# EAGLE schematic controller (EAGLE 9.6.0)
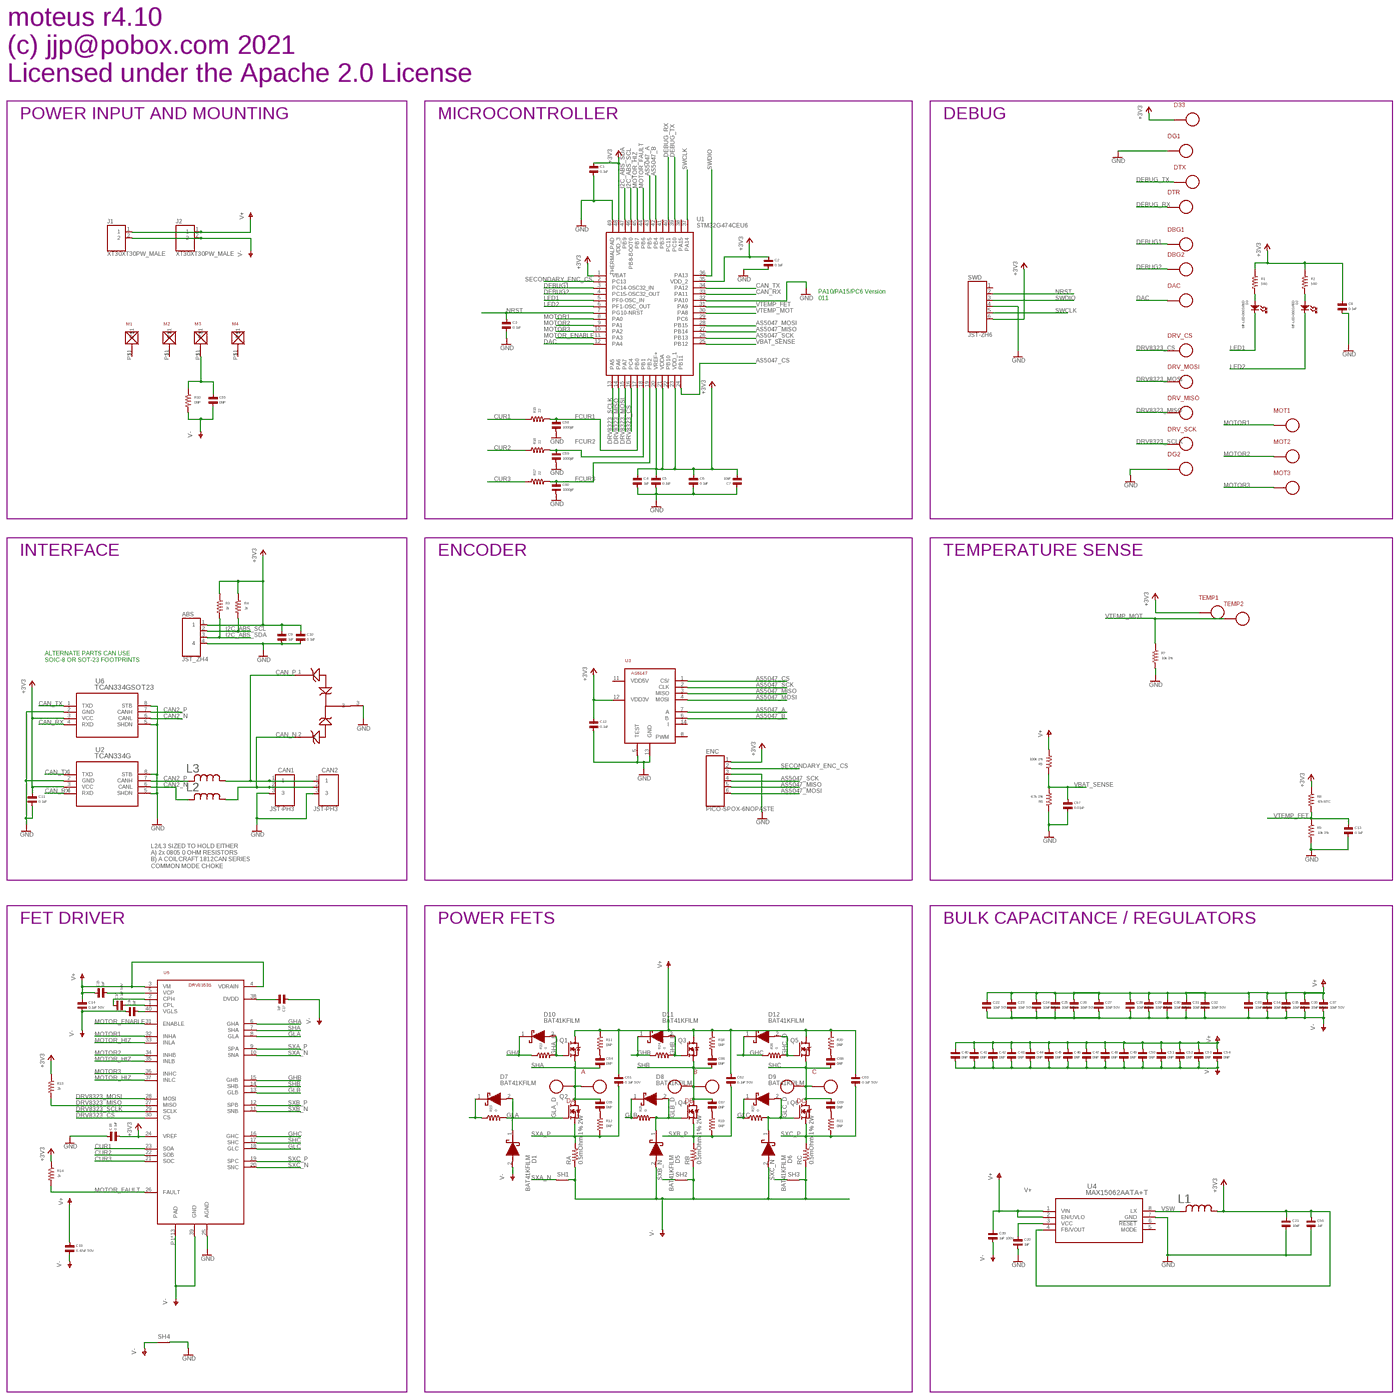
[diagram p0: schematic, sheet 1, overview]
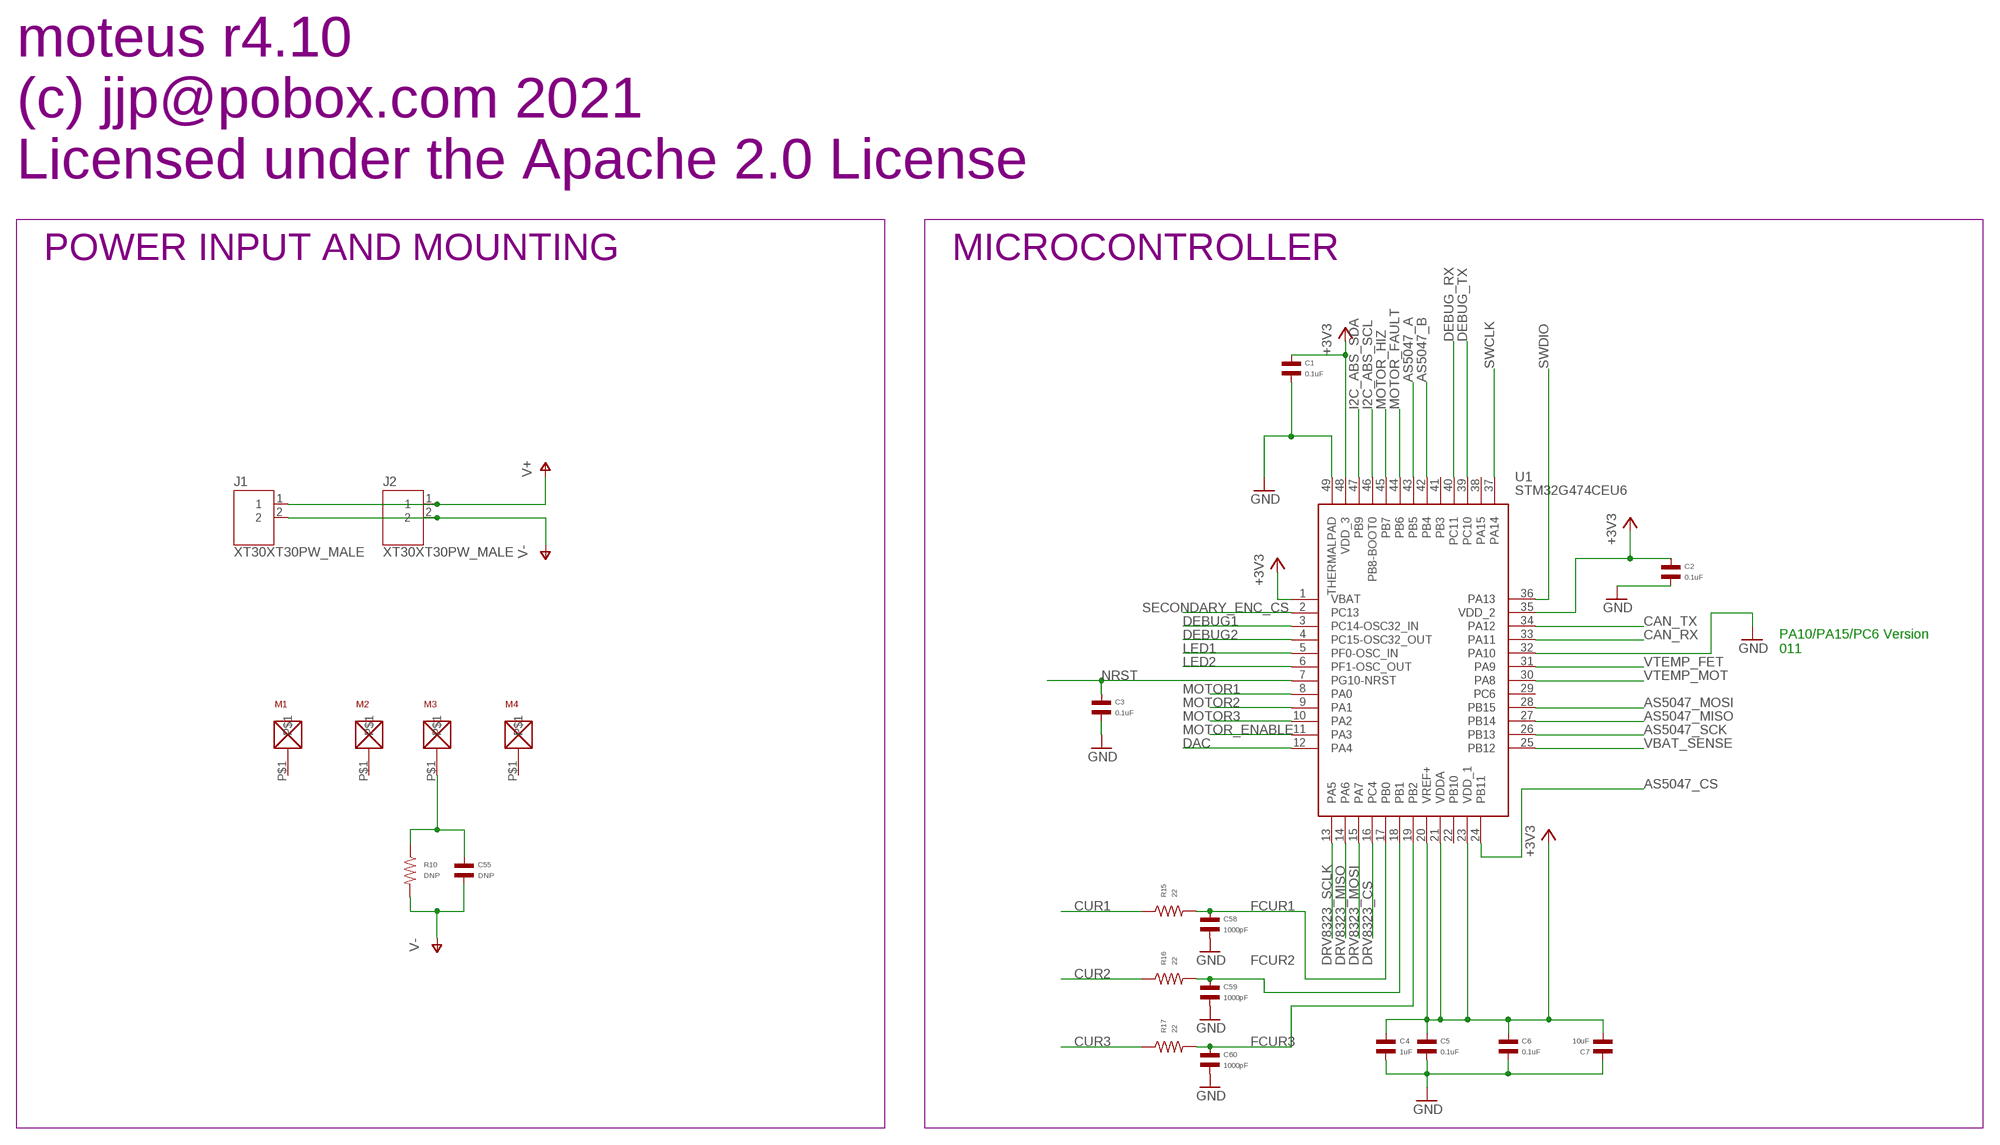
[diagram p1: schematic, sheet 1, part 1 of 4]
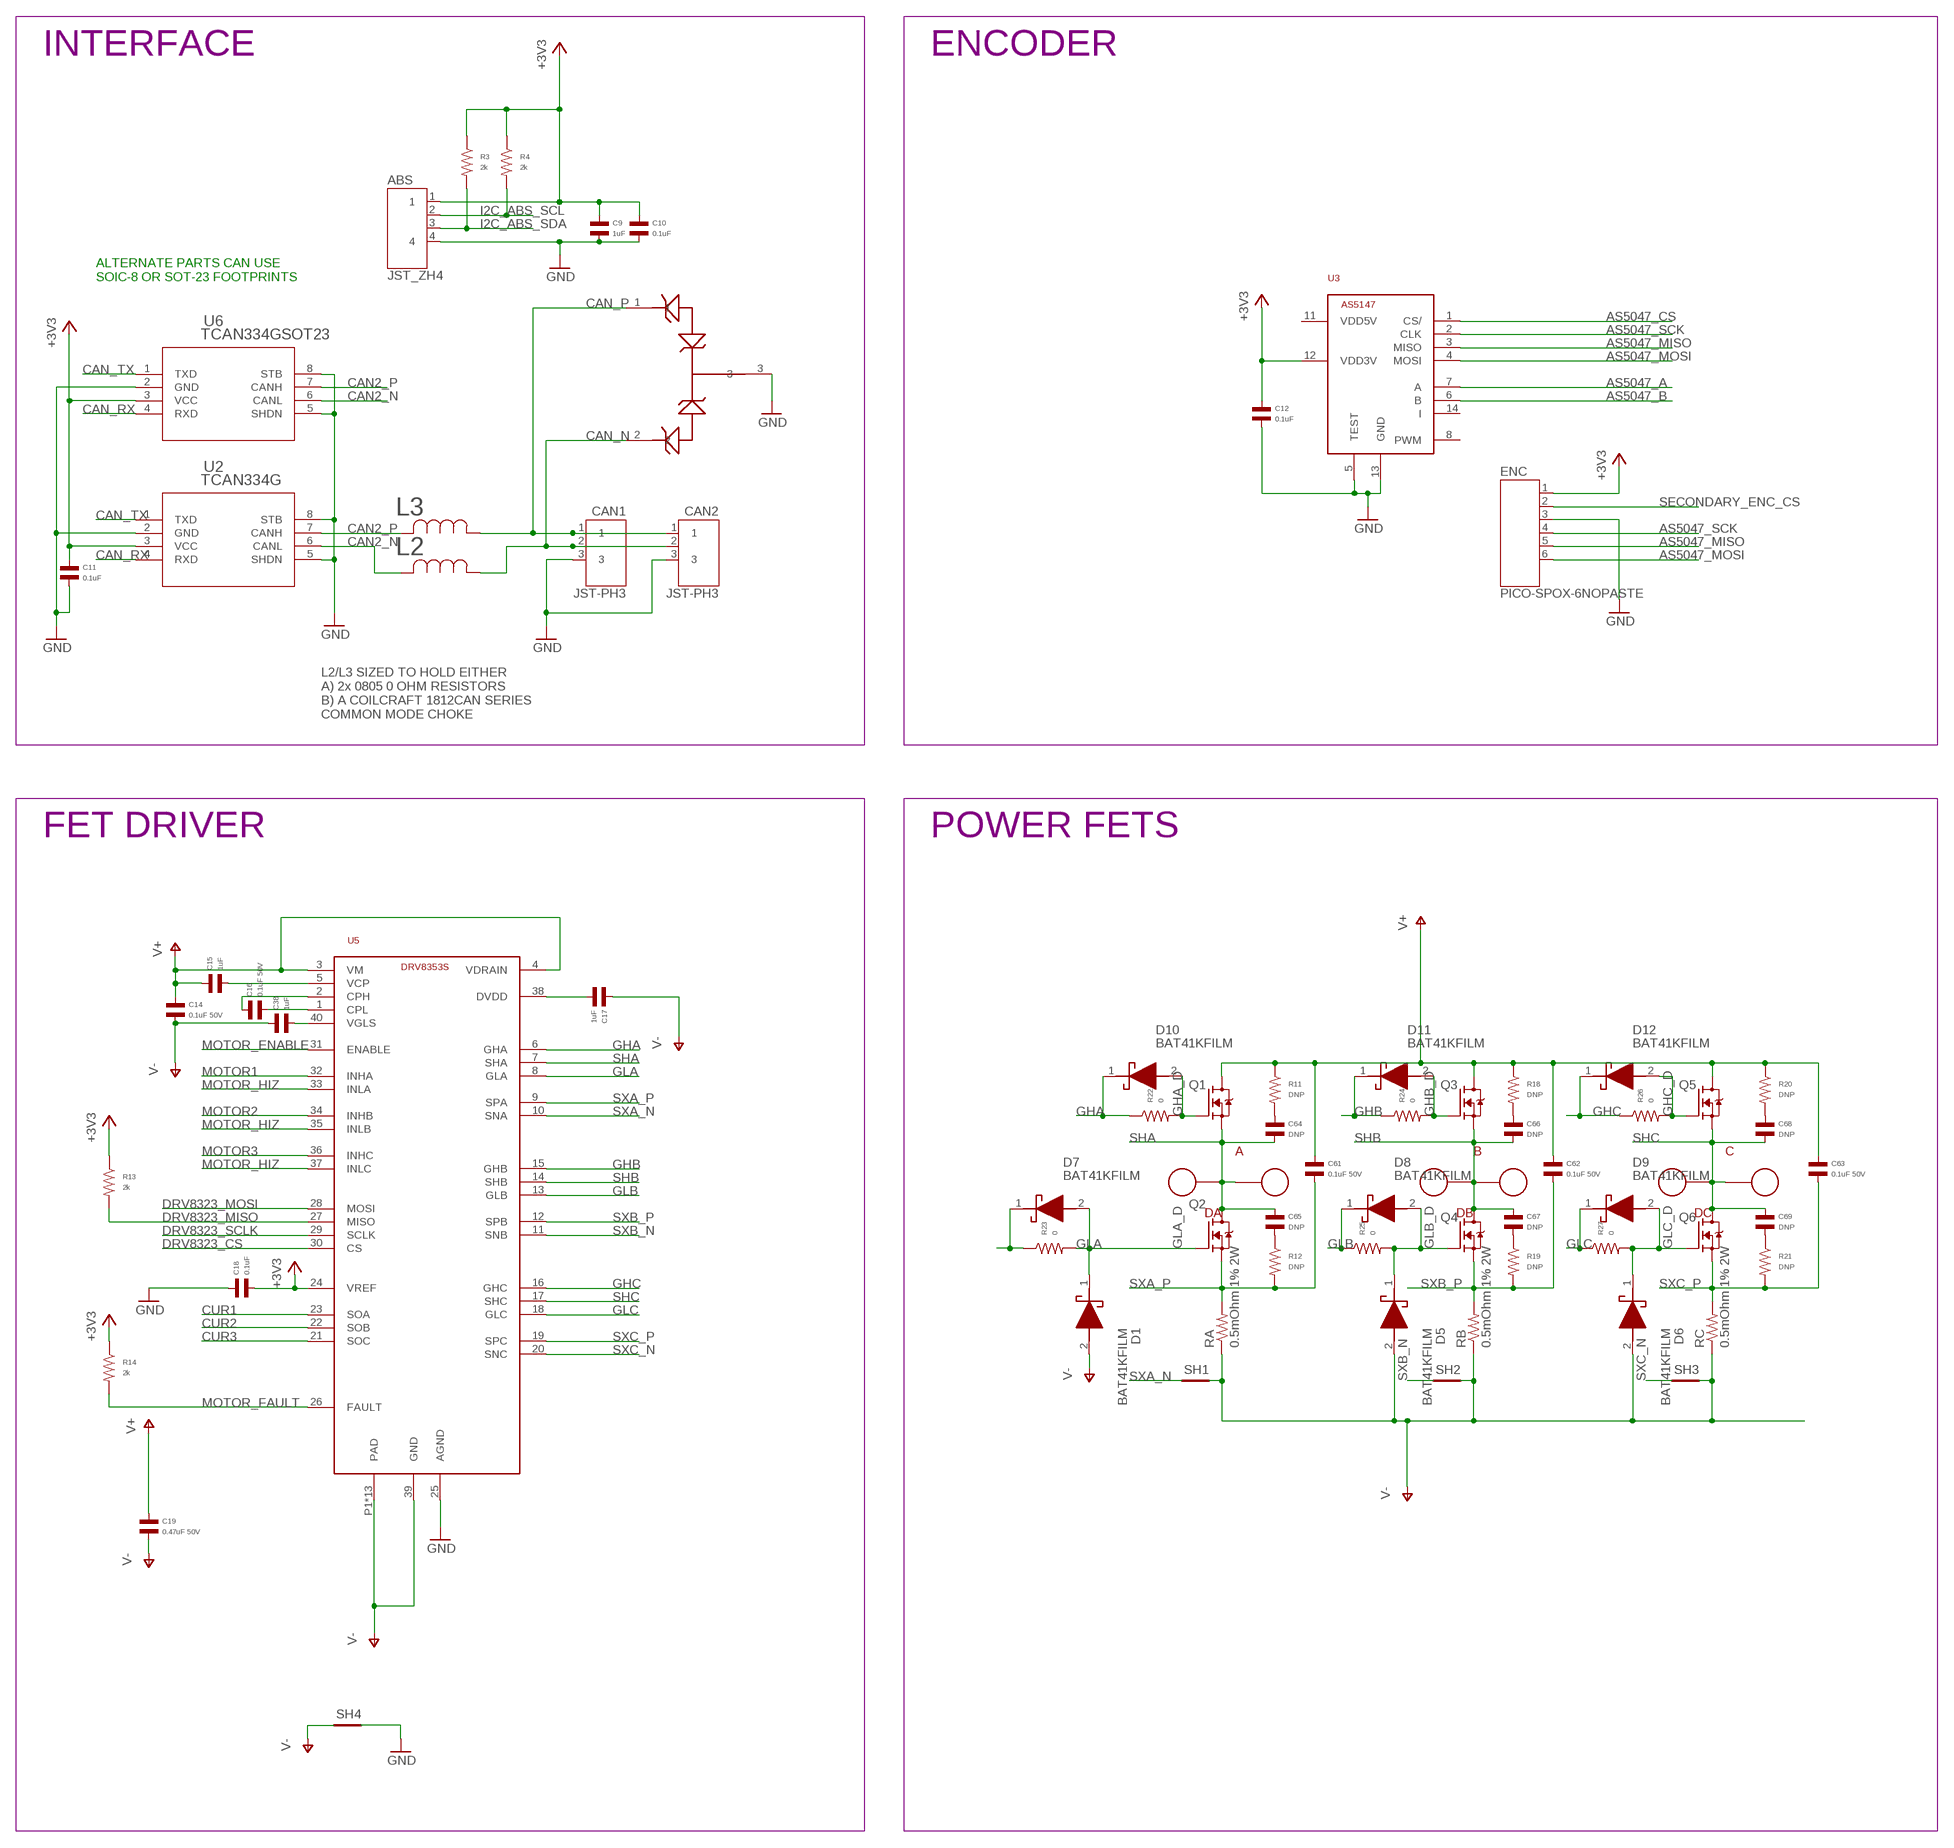
[diagram p2: schematic, sheet 1, part 2 of 4]
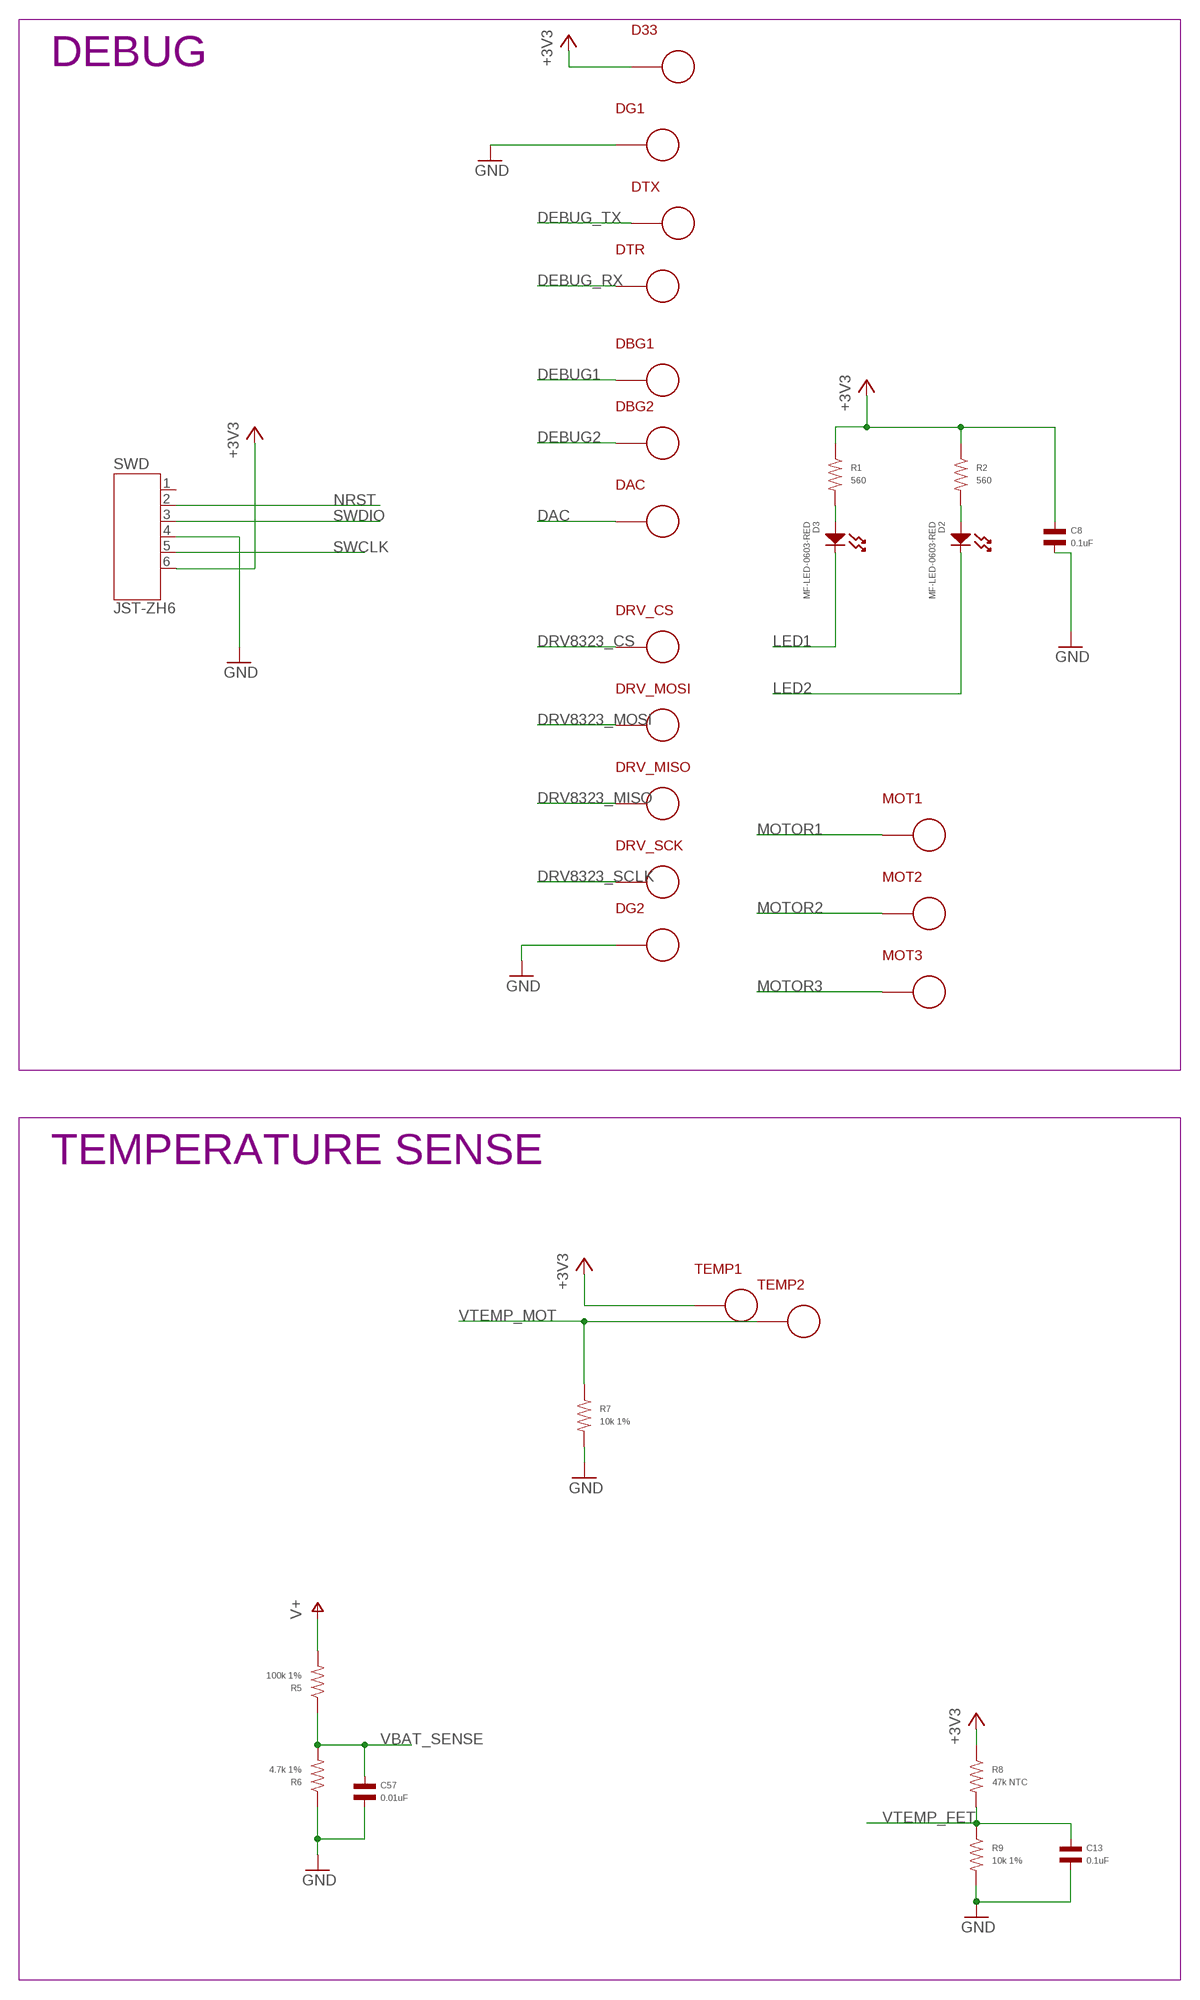
[diagram p3: schematic, sheet 1, part 3 of 4]
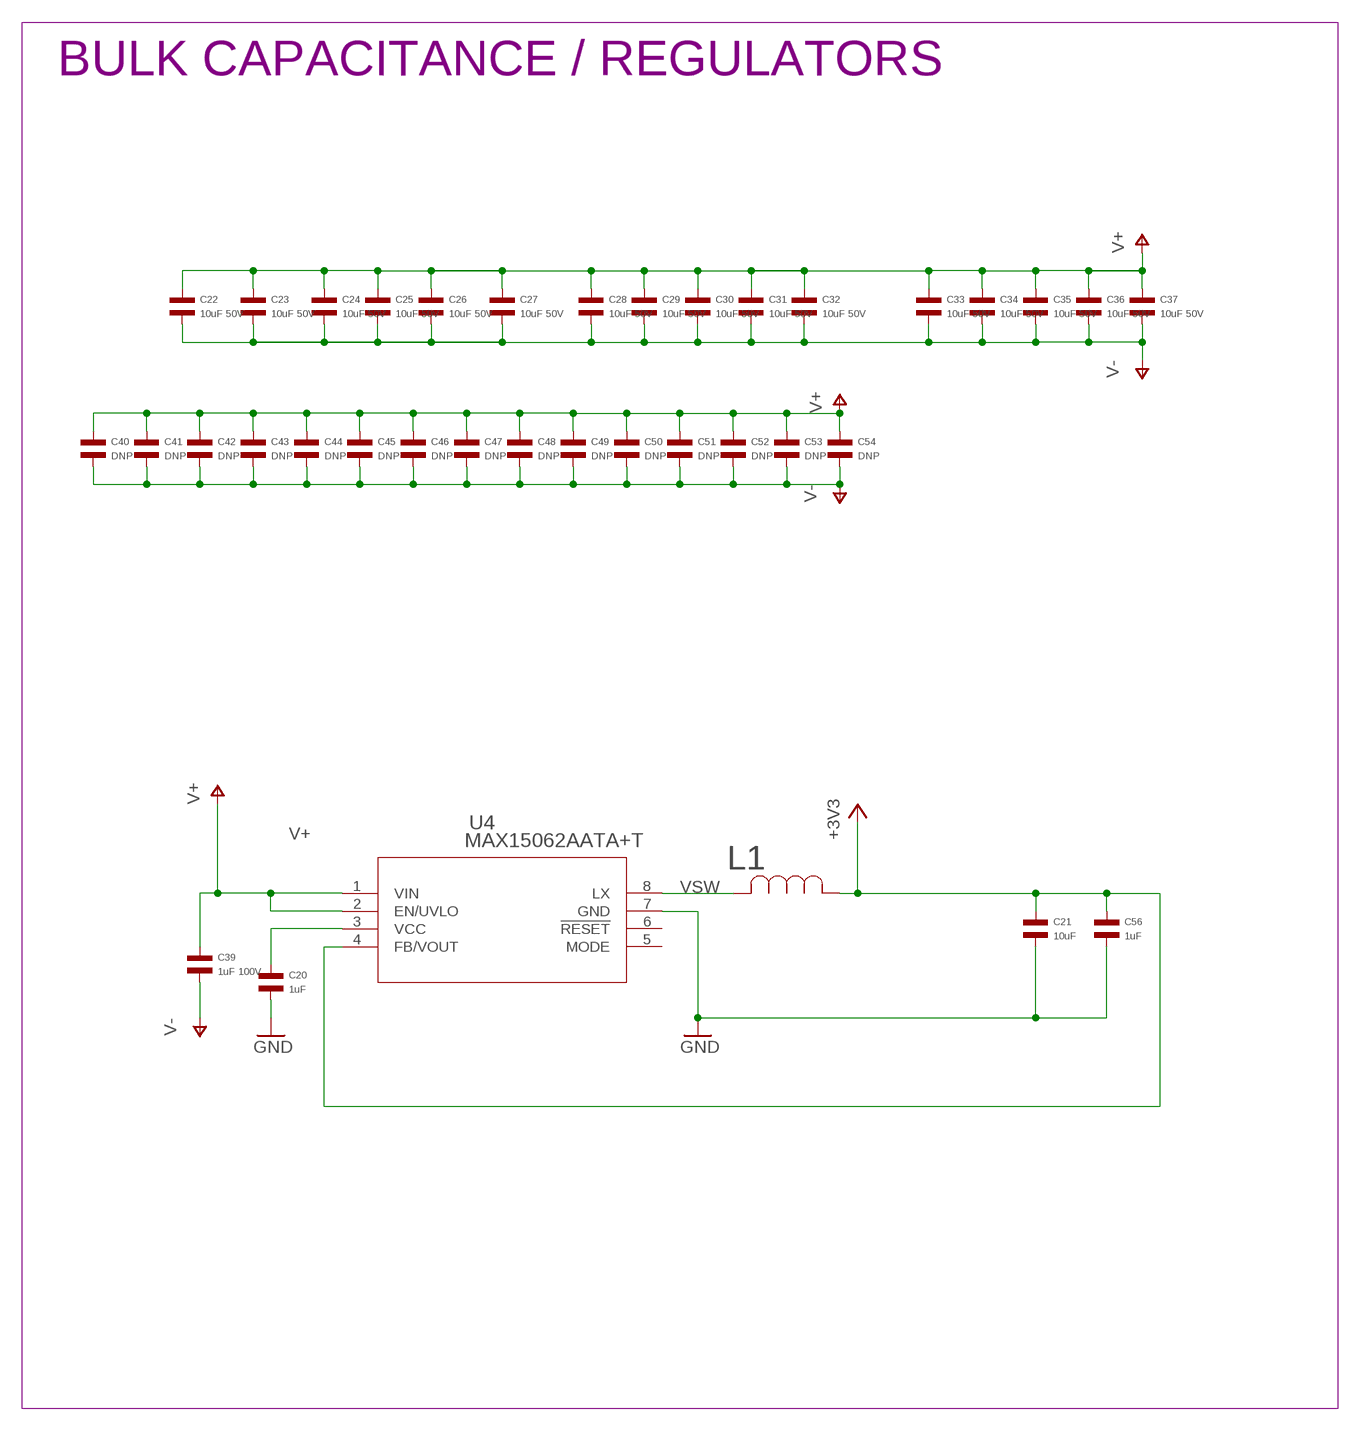
[diagram p4: schematic, sheet 1, part 4 of 4]

## Parts
A  PAD16AWG_PAD  [16AWG_PAD]
ABS  JST_ZH4  [JST_S4B-ZR-SM4A-TF(LF)(SN)]
B  PAD16AWG_PAD  [16AWG_PAD]
C  PAD16AWG_PAD  [16AWG_PAD]
C1  0.1uF  CAPACITOR_NP_0402  [C0402]
C2  0.1uF  CAPACITOR_NP_0402  [C0402]
C3  0.1uF  CAPACITOR_NP_0402  [C0402]
C4  1uF  CAPACITOR_NP_0402  [C0402]
C5  0.1uF  CAPACITOR_NP_0402  [C0402]
C6  0.1uF  CAPACITOR_NP_0402  [C0402]
C7  10uF  CAPACITOR_NP_1206  [C1206]
C8  0.1uF  CAPACITOR_NP_0402  [C0402]
C9  1uF  CAPACITOR_NP_0402  [C0402]
C10  0.1uF  CAPACITOR_NP_0402  [C0402]
C11  0.1uF  CAPACITOR_NP_0402_NOBORDER  [C0402_NOBORDER]
C12  0.1uF  CAPACITOR_NP_0402  [C0402]
C13  0.1uF  CAPACITOR_NP_0402  [C0402]
C14  0.1uF 50V  CAPACITOR_NP_0402  [C0402]
C15  1uF  CAPACITOR_NP_0402  [C0402]
C16  0.1uF 50V  CAPACITOR_NP_0402  [C0402]
C17  1uF  CAPACITOR_NP_0402  [C0402]
C18  0.1uF  CAPACITOR_NP_0402  [C0402]
C19  0.47uF 50V  CAPACITOR_NP_0402  [C0402]
C20  1uF  CAPACITOR_NP_0603  [C0603]
C21  10uF  CAPACITOR_NP_1206  [C1206]
C22  10uF 50V  CAPACITOR_NP_1206  [C1206]
C23  10uF 50V  CAPACITOR_NP_1206  [C1206]
C24  10uF 50V  CAPACITOR_NP_1206  [C1206]
C25  10uF 50V  CAPACITOR_NP_1206  [C1206]
C26  10uF 50V  CAPACITOR_NP_1206  [C1206]
C27  10uF 50V  CAPACITOR_NP_1206  [C1206]
C28  10uF 50V  CAPACITOR_NP_1206  [C1206]
C29  10uF 50V  CAPACITOR_NP_1206  [C1206]
C30  10uF 50V  CAPACITOR_NP_1206  [C1206]
C31  10uF 50V  CAPACITOR_NP_1206  [C1206]
C32  10uF 50V  CAPACITOR_NP_1206  [C1206]
C33  10uF 50V  CAPACITOR_NP_1206  [C1206]
C34  10uF 50V  CAPACITOR_NP_1206  [C1206]
C35  10uF 50V  CAPACITOR_NP_1206_NOBORDER  [C1206_NOBORDER]
C36  10uF 50V  CAPACITOR_NP_1206  [C1206]
C37  10uF 50V  CAPACITOR_NP_1206  [C1206]
C38  1uF  CAPACITOR_NP_0603  [C0603]
C39  1uF 100V  CAPACITOR_NP_0805  [C0805]
C40  DNP  CAPACITOR_NP_1206_NOCREAM  [C1206_NOCREAM]
C41  DNP  CAPACITOR_NP_1206_NOCREAM  [C1206_NOCREAM]
C42  DNP  CAPACITOR_NP_1206_NOCREAM  [C1206_NOCREAM]
C43  DNP  CAPACITOR_NP_1206_NOCREAM  [C1206_NOCREAM]
C44  DNP  CAPACITOR_NP_1206_NOCREAM  [C1206_NOCREAM]
C45  DNP  CAPACITOR_NP_1206_NOCREAM  [C1206_NOCREAM]
C46  DNP  CAPACITOR_NP_1206_NOCREAM  [C1206_NOCREAM]
C47  DNP  CAPACITOR_NP_1206_NOCREAM  [C1206_NOCREAM]
C48  DNP  CAPACITOR_NP_1206_NOCREAM  [C1206_NOCREAM]
C49  DNP  CAPACITOR_NP_1206_NOCREAM  [C1206_NOCREAM]
C50  DNP  CAPACITOR_NP_1206_NOCREAM  [C1206_NOCREAM]
C51  DNP  CAPACITOR_NP_1206_NOCREAM  [C1206_NOCREAM]
C52  DNP  CAPACITOR_NP_1206_NOCREAM  [C1206_NOCREAM]
C53  DNP  CAPACITOR_NP_1206_NOCREAM  [C1206_NOCREAM]
C54  DNP  CAPACITOR_NP_1206_NOCREAM  [C1206_NOCREAM]
C55  DNP  CAPACITOR_NP_0402  [C0402]
C56  1uF  CAPACITOR_NP_0402  [C0402]
C57  0.01uF  CAPACITOR_NP_0402  [C0402]
C58  1000pF  CAPACITOR_NP_0402_NOBORDER  [C0402_NOBORDER]
C59  1000pF  CAPACITOR_NP_0402_NOBORDER  [C0402_NOBORDER]
C60  1000pF  CAPACITOR_NP_0402_NOBORDER  [C0402_NOBORDER]
C61  0.1uF 50V  CAPACITOR_NP_1206  [C1206]
C62  0.1uF 50V  CAPACITOR_NP_0603_NOBORDER  [C0603_NOBORDER]
C63  0.1uF 50V  CAPACITOR_NP_1206  [C1206]
C64  DNP  CAPACITOR_NP_0603  [C0603]
C65  DNP  CAPACITOR_NP_0603  [C0603]
C66  DNP  CAPACITOR_NP_0603  [C0603]
C67  DNP  CAPACITOR_NP_0603  [C0603]
C68  DNP  CAPACITOR_NP_0603  [C0603]
C69  DNP  CAPACITOR_NP_0603  [C0603]
CAN1  JST-PH3  [JST_S3B-PH-SM4-TB(LF)(SN)]
CAN2  JST-PH3  [JST_S3B-PH-SM4-TB(LF)(SN)]
D1  BAT41KFILM  [SODFL1608X70N]
D2  MF-LED-0603-RED  LED_SINGLE-0603-RED  [LED0603]
D3  MF-LED-0603-RED  LED_SINGLE-0603-RED  [LED0603]
D4  DUAL_TVS  [SOT23-3]
D5  BAT41KFILM  [SODFL1608X70N]
D6  BAT41KFILM  [SODFL1608X70N]
D7  BAT41KFILM  [SODFL1608X70N]
D8  BAT41KFILM  [SODFL1608X70N]
D9  BAT41KFILM  [SODFL1608X70N]
D10  BAT41KFILM  [SODFL1608X70N]
D11  BAT41KFILM  [SODFL1608X70N]
D12  BAT41KFILM  [SODFL1608X70N]
D33  PAD24AWG_PAD  [24AWG_PAD]
DA  PAD24AWG_PAD  [24AWG_PAD]
DAC  PAD24AWG_PAD  [24AWG_PAD]
DB  PAD24AWG_PAD  [24AWG_PAD]
DBG1  PAD24AWG_PAD  [24AWG_PAD]
DBG2  PAD24AWG_PAD  [24AWG_PAD]
DC  PAD24AWG_PAD  [24AWG_PAD]
DG1  PAD24AWG_PAD  [24AWG_PAD]
DG2  PAD24AWG_PAD  [24AWG_PAD]
DRV_CS  PAD24AWG_PAD  [24AWG_PAD]
DRV_MISO  PAD24AWG_PAD  [24AWG_PAD]
DRV_MOSI  PAD24AWG_PAD  [24AWG_PAD]
DRV_SCK  PAD24AWG_PAD  [24AWG_PAD]
DTR  PAD24AWG_PAD  [24AWG_PAD]
DTX  PAD24AWG_PAD  [24AWG_PAD]
ENC  PICO-SPOX-6NOPASTE  [PICO-SPOX-SMT-RA-6-NOPASTE]
J1  XT30XT30PW_MALE  [XT30PW_MALE]
J2  XT30XT30PW_MALE  [XT30PW_MALE]
L1  SRN4018-220M  [IND_BOURNS_SRN4018]
L2  HALF_CHOKE  [1812_COMMON_HALF]
L3  HALF_CHOKE  [1812_COMMON_HALF]
M1  MOUNT  [M2.5MOUNT]
M2  MOUNT  [M2.5MOUNT]
M3  MOUNT  [M2.5MOUNT]
M4  MOUNT  [M2.5MOUNT]
MOT1  PAD24AWG_PAD  [24AWG_PAD]
MOT2  PAD24AWG_PAD  [24AWG_PAD]
MOT3  PAD24AWG_PAD  [24AWG_PAD]
Q1  TPH1R204PLSOP_ADVANCE_8  [SOP_ADVANCE_8]
Q2  TPH1R204PLSOP_ADVANCE_8  [SOP_ADVANCE_8]
Q3  TPH1R204PLSOP_ADVANCE_8  [SOP_ADVANCE_8]
Q4  TPH1R204PLSOP_ADVANCE_8  [SOP_ADVANCE_8]
Q5  TPH1R204PLSOP_ADVANCE_8  [SOP_ADVANCE_8]
Q6  TPH1R204PLSOP_ADVANCE_8  [SOP_ADVANCE_8]
R1  560  RESISTOR_0402  [R0402]
R2  560  RESISTOR_0402  [R0402]
R3  2k  RESISTOR_0402  [R0402]
R4  2k  RESISTOR_0402  [R0402]
R5  100k 1%  RESISTOR_0402  [R0402]
R6  4.7k 1%  RESISTOR_0402  [R0402]
R7  10k 1%  RESISTOR_0402  [R0402]
R8  47k NTC  RESISTOR_0402  [R0402]
R9  10k 1%  RESISTOR_0402  [R0402]
R10  DNP  RESISTOR_0402  [R0402]
R11  DNP  RESISTOR_0603  [R0603]
R12  DNP  RESISTOR_0603  [R0603]
R13  2k  RESISTOR_0402  [R0402]
R14  2k  RESISTOR_0402  [R0402]
R15  22  RESISTOR_0402_NOBORDER  [R0402_NOBORDER]
R16  22  RESISTOR_0402_NOBORDER  [R0402_NOBORDER]
R17  22  RESISTOR_0402_NOBORDER  [R0402_NOBORDER]
R18  DNP  RESISTOR_0603  [R0603]
R19  DNP  RESISTOR_0603  [R0603]
R20  DNP  RESISTOR_0603  [R0603]
R21  DNP  RESISTOR_0603  [R0603]
R22  0  RESISTOR_0402  [R0402]
R23  0  RESISTOR_0402  [R0402]
R24  0  RESISTOR_0402  [R0402]
R25  0  RESISTOR_0402  [R0402]
R26  0  RESISTOR_0402  [R0402]
R27  0  RESISTOR_0402  [R0402]
RA  0.5mOhm 1% 2W  R-US_M1206  [M1206]
RB  0.5mOhm 1% 2W  R-US_M1206  [M1206]
RC  0.5mOhm 1% 2W  R-US_M1206  [M1206]
SH1  SHORTT5  [SHORT_TOP-50]
SH2  SHORTT5  [SHORT_TOP-50]
SH3  SHORTT5  [SHORT_TOP-50]
SH4  SHORTMEDIUM  [SHORT_TOP-MEDIUM]
SWD  JST-ZH6  [JST_S6B-ZR-SM4A-TF(LF)(SN)]
TEMP1  PAD24AWG_PAD  [24AWG_PAD]
TEMP2  PAD24AWG_PAD  [24AWG_PAD]
U1  STM32G474CEU6  [QFN50P700X700X60-49N]
U2  TCAN334G  [SOIC8]
U3  AS5147  [TSSOP14]
U4  MAX15062AATA+T  [21-0487A_MXM]
U5  DRV8353S  [WQFN-40]
U6  TCAN334GSOT23  [SOT23-8]

## Nets
+3V3: ABS.1 C1.P$1 C2.P$1 C4.P$1 C5.P$1 C6.P$1 C7.P$2 C8.P$1 C9.P$1 C10.P$1 C11.P$1 C12.P$1 C18.P$2 C21.P$1 C56.P$1 D33.P$1 ENC.1 L1.1 R1.P$1 R2.P$1 R3.P$1 R4.P$1 R8.P$1 R13.P$1 R14.P$1 SWD.6 TEMP1.P$1 U1.1(VBAT) U1.20(VREF+) U1.21(VDDA) U1.23(VDD_1) U1.35(VDD_2) U1.48(VDD_3) U2.3(VCC) U3.12(VDD3V) U4.4(FB/VOUT) U5.24(VREF) U6.3(VCC)
AS5047_A: U1.43(PB5) U3.7(A)
AS5047_B: U1.42(PB4) U3.6(B)
AS5047_CS: U1.24(PB11) U3.1(CS/)
AS5047_MISO: ENC.5 U1.27(PB14) U3.3(MISO)
AS5047_MOSI: ENC.6 U1.28(PB15) U3.4(MOSI)
AS5047_SCK: ENC.4 U1.26(PB13) U3.2(CLK)
CAN2_N: L2.P$2 U2.6(CANL) U6.6(CANL)
CAN2_P: L3.P$2 U2.7(CANH) U6.7(CANH)
CAN_N [CAN]: CAN1.2 CAN2.2 D4.2 L2.P$1
CAN_P [CAN]: CAN1.1 CAN2.1 D4.1 L3.P$1
CAN_RX: U1.33(PA11) U2.4(RXD) U6.4(RXD)
CAN_TX: U1.34(PA12) U2.1(TXD) U6.1(TXD)
CUR1: R15.P$1 U5.23(SOA)
CUR2: R16.P$1 U5.22(SOB)
CUR3: R17.P$1 U5.21(SOC)
DAC: DAC.P$1 U1.12(PA4)
DEBUG1: DBG1.P$1 U1.3(PC14-OSC32_IN)
DEBUG2: DBG2.P$1 U1.4(PC15-OSC32_OUT)
DEBUG_RX: DTR.P$1 U1.40(PC11)
DEBUG_TX: DTX.P$1 U1.39(PC10)
DRV8323_CS: DRV_CS.P$1 U1.16(PC4) U5.30(CS)
DRV8323_MISO: DRV_MISO.P$1 R13.P$2 U1.14(PA6) U5.27(MISO)
DRV8323_MOSI: DRV_MOSI.P$1 U1.15(PA7) U5.28(MOSI)
DRV8323_SCLK: DRV_SCK.P$1 U1.13(PA5) U5.29(SCLK)
FCUR1: C58.P$1 R15.P$2 U1.17(PB0)
FCUR2: C59.P$1 R16.P$2 U1.18(PB1)
FCUR3: C60.P$1 R17.P$2 U1.19(PB2)
GHA: D10.1(K) R22.P$1 U5.6(GHA)
GHA_D: D10.2(A) Q1.4(G) R22.P$2
GHB: D11.1(K) R24.P$1 U5.15(GHB)
GHB_D: D11.2(A) Q3.4(G) R24.P$2
GHC: D12.1(K) R26.P$1 U5.16(GHC)
GHC_D: D12.2(A) Q5.4(G) R26.P$2
GLA: D7.1(K) R23.P$1 U5.8(GLA)
GLA_D: D1.1(K) D7.2(A) Q2.4(G) R23.P$2
GLB: D8.1(K) R25.P$1 U5.13(GLB)
GLB_D: D5.1(K) D8.2(A) Q4.4(G) R25.P$2
GLC: D9.1(K) R27.P$1 U5.18(GLC)
GLC_D: D6.1(K) D9.2(A) Q6.4(G) R27.P$2
GND: ABS.4 C1.P$2 C2.P$2 C3.P$2 C4.P$2 C5.P$2 C6.P$2 C7.P$1 C8.P$2 C9.P$2 C10.P$2 C11.P$2 C12.P$2 C13.P$2 C18.P$1 C20.P$2 C21.P$2 C56.P$2 C57.P$2 C58.P$2 C59.P$2 C60.P$2 CAN1.3 CAN2.3 D4.3 DG1.P$1 DG2.P$1 ENC.3 R6.P$1 R7.P$2 R9.P$2 SH4.2 SWD.4 U1.32(PA10) U1.49(THERMALPAD) U2.2(GND) U2.5(SHDN) U2.8(STB) U3.5(TEST) U3.13(GND) U4.7(GND) U5.25(AGND) U6.2(GND) U6.5(SHDN) U6.8(STB)
I2C_ABS_SCL: ABS.2 R4.P$2 U1.46(PB8-BOOT0)
I2C_ABS_SDA: ABS.3 R3.P$2 U1.47(PB9)
LED1: D3.CATHODE U1.5(PF0-OSC_IN)
LED2: D2.CATHODE U1.6(PF1-OSC_OUT)
MOTOR1: MOT1.P$1 U1.8(PA0) U5.32(INHA)
MOTOR2: MOT2.P$1 U1.9(PA1) U5.34(INHB)
MOTOR3: MOT3.P$1 U1.10(PA2) U5.36(INHC)
MOTOR_ENABLE: U1.11(PA3) U5.31(ENABLE)
MOTOR_FAULT: R14.P$2 U1.44(PB6) U5.26(FAULT)
MOTOR_HIZ: U1.45(PB7) U5.33(INLA) U5.35(INLB) U5.37(INLC)
N$1: C55.P$1 M3.P$1 R10.P$1
N$2: C38.P$2 U5.40(VGLS)
N$3: C64.P$1 R11.P$2
N$4: C20.P$1 U4.3(VCC)
N$5: C65.P$2 R12.P$1
N$6: C66.P$1 R18.P$2
N$7: C67.P$2 R19.P$1
N$8: C68.P$1 R20.P$2
N$9: C69.P$2 R21.P$1
N$10: C16.P$2 U5.1(CPL)
N$13: C16.P$1 U5.2(CPH)
N$14: C15.P$2 U5.5(VCP)
N$16: C17.P$2 U5.38(DVDD)
N$17: D3.ANODE R1.P$2
N$18: D2.ANODE R2.P$2
NRST: C3.P$1 SWD.2 U1.7(PG10-NRST)
SECONDARY_ENC_CS: ENC.2 U1.2(PC13)
SHA: A.1 C64.P$2 C65.P$1 DA.P$1 Q1.1(S) Q1.2(S) Q1.3(S) Q2.5(D) Q2.6(D) Q2.7(D) Q2.8(D) Q2.PAD(D) U5.7(SHA)
SHB: B.1 C66.P$2 C67.P$1 DB.P$1 Q3.1(S) Q3.2(S) Q3.3(S) Q4.5(D) Q4.6(D) Q4.7(D) Q4.8(D) Q4.PAD(D) U5.14(SHB)
SHC: C68.P$2 C69.P$1 C.1 DC.P$1 Q5.1(S) Q5.2(S) Q5.3(S) Q6.5(D) Q6.6(D) Q6.7(D) Q6.8(D) Q6.PAD(D) U5.17(SHC)
SWCLK: SWD.5 U1.37(PA14)
SWDIO: SWD.3 U1.36(PA13)
SXA_N: SH1.1 U5.10(SNA)
SXA_P: C61.P$2 Q2.1(S) Q2.2(S) Q2.3(S) R12.P$2 RA.2 U5.9(SPA)
SXB_N: SH2.1 U5.11(SNB)
SXB_P: C62.P$2 Q4.1(S) Q4.2(S) Q4.3(S) R19.P$2 RB.2 U5.12(SPB)
SXC_N: SH3.1 U5.20(SNC)
SXC_P: C63.P$2 Q6.1(S) Q6.2(S) Q6.3(S) R21.P$2 RC.2 U5.19(SPC)
V+: C14.P$1 C15.P$1 C19.P$1 C22.P$1 C23.P$1 C24.P$1 C25.P$1 C26.P$1 C27.P$1 C28.P$1 C29.P$1 C30.P$1 C31.P$1 C32.P$1 C33.P$1 C34.P$1 C35.P$1 C36.P$1 C37.P$1 C39.P$1 C40.P$1 C41.P$1 C42.P$1 C43.P$1 C44.P$1 C45.P$1 C46.P$1 C47.P$1 C48.P$1 C49.P$1 C50.P$1 C51.P$1 C52.P$1 C53.P$1 C54.P$1 C61.P$1 C62.P$1 C63.P$1 J1.1 J2.1 Q1.5(D) Q1.6(D) Q1.7(D) Q1.8(D) Q1.PAD(D) Q3.5(D) Q3.6(D) Q3.7(D) Q3.8(D) Q3.PAD(D) Q5.5(D) Q5.6(D) Q5.7(D) Q5.8(D) Q5.PAD(D) R5.P$2 R11.P$1 R18.P$1 R20.P$1 U4.1(VIN) U4.2(EN/UVLO) U5.3(VM) U5.4(VDRAIN)
V-: C14.P$2 C17.P$1 C19.P$2 C22.P$2 C23.P$2 C24.P$2 C25.P$2 C26.P$2 C27.P$2 C28.P$2 C29.P$2 C30.P$2 C31.P$2 C32.P$2 C33.P$2 C34.P$2 C35.P$2 C36.P$2 C37.P$2 C38.P$1 C39.P$2 C40.P$2 C41.P$2 C42.P$2 C43.P$2 C44.P$2 C45.P$2 C46.P$2 C47.P$2 C48.P$2 C49.P$2 C50.P$2 C51.P$2 C52.P$2 C53.P$2 C54.P$2 C55.P$2 D1.2(A) D5.2(A) D6.2(A) J1.2 J2.2 R10.P$2 RA.1 RB.1 RC.1 SH1.2 SH2.2 SH3.2 SH4.1 U5.39(GND) U5.P1(PAD) U5.P2(PAD) U5.P3(PAD) U5.P7(PAD) U5.P8(PAD) U5.P9(PAD) U5.P12(PAD) U5.P13(PAD) U5.P14(PAD) U5.P17(PAD) U5.P18(PAD) U5.P19(PAD) U5.PAD
VBAT_SENSE: C57.P$1 R5.P$1 R6.P$2 U1.25(PB12)
VSW: L1.2 U4.8(LX)
VTEMP_FET: C13.P$1 R8.P$2 R9.P$1 U1.31(PA9)
VTEMP_MOT: R7.P$1 TEMP2.P$1 U1.30(PA8)
Unconnected: M1.P$1 M2.P$1 M4.P$1 SWD.1 U1.22(PB10) U1.29(PC6) U1.38(PA15) U1.41(PB3) U3.8(PWM) U3.11(VDD5V) U3.14(I) U4.5(MODE) U4.6(!RESET)

## Notes on the sheet
- moteus r4.10
  (c) jjp@pobox.com 2021
  Licensed under the Apache 2.0 License
- POWER INPUT AND MOUNTING | MICROCONTROLLER | DEBUG
- PA10/PA15/PC6 Version
  011
- INTERFACE | ENCODER | TEMPERATURE SENSE
- ALTERNATE PARTS CAN USE
  SOIC-8 OR SOT-23 FOOTPRINTS
- L2/L3 SIZED TO HOLD EITHER
  A) 2x 0805 0 OHM RESISTORS
  B) A COILCRAFT 1812CAN SERIES
  COMMON MODE CHOKE
- FET DRIVER | POWER FETS | BULK CAPACITANCE / REGULATORS

## Library data of the parts
A B C D33 DA DAC DB DBG1 DBG2 DC DG1 DG2 DRV_CS DRV_MISO DRV_MOSI DRV_SCK DTR DTX MOT1-MOT3 TEMP1 TEMP2 = controller:PAD; POPULATE: 0
ABS = controller:JST_ZH4; MF: JST; MPN: S4B-ZR-SM4A-TF(LF)(SN); POPULATE: 1
C1-C3 C5 C6 C8 C10 C12 C13 C18 = mfpassives:CAPACITOR_NP: Library: MF_Passives Description: Device for Non-Polarized Capacitors. Manufacture part number (MPN) can be added via Attributes. Check https://factory.macrofab.com/parts for the house parts list.; HOUSEPART: YES; MPN: MF-CAP-0402-0.1uF; POPULATE: 1
C4 C9 C15 C17 C56 = mfpassives:CAPACITOR_NP: Library: MF_Passives Description: Device for Non-Polarized Capacitors. Manufacture part number (MPN) can be added via Attributes. Check https://factory.macrofab.com/parts for the house parts list.; HOUSEPART: YES; MPN: MF-CAP-0402-1uF; POPULATE: 1
C7 = mfpassives:CAPACITOR_NP: Library: MF_Passives Description: Device for Non-Polarized Capacitors. Manufacture part number (MPN) can be added via Attributes. Check https://factory.macrofab.com/parts for the house parts list.; HOUSEPART: YES; MPN: MF-CAP-1206-10uF; POPULATE: 1
C11 = controller:CAPACITOR_NP: Library: MF_Passives Description: Device for Non-Polarized Capacitors. Manufacture part number (MPN) can be added via Attributes. Check https://factory.macrofab.com/parts for the house parts list.; HOUSEPART: YES; MPN: MF-CAP-0402-0.1uF; POPULATE: 1
C14 C16 = mfpassives:CAPACITOR_NP: Library: MF_Passives Description: Device for Non-Polarized Capacitors. Manufacture part number (MPN) can be added via Attributes. Check https://factory.macrofab.com/parts for the house parts list.; MF: TDK; MPN: CGA2B3X7R1H104K050BB; POPULATE: 1
C19 = mfpassives:CAPACITOR_NP: Library: MF_Passives Description: Device for Non-Polarized Capacitors. Manufacture part number (MPN) can be added via Attributes. Check https://factory.macrofab.com/parts for the house parts list.; MF: Murata; MPN: GRM155R61H474KE11D; POPULATE: 1
C20 = mfpassives:CAPACITOR_NP: Library: MF_Passives Description: Device for Non-Polarized Capacitors. Manufacture part number (MPN) can be added via Attributes. Check https://factory.macrofab.com/parts for the house parts list.; HOUSEPART: 1; MPN: MF-CAP-0603-1uF; POPULATE: 1
C21 = mfpassives:CAPACITOR_NP: Library: MF_Passives Description: Device for Non-Polarized Capacitors. Manufacture part number (MPN) can be added via Attributes. Check https://factory.macrofab.com/parts for the house parts list.; HOUSEPART: 1; MPN: MF-CAP-1206-10uF; POPULATE: 1
C22-C34 C36 C37 = mfpassives:CAPACITOR_NP: Library: MF_Passives Description: Device for Non-Polarized Capacitors. Manufacture part number (MPN) can be added via Attributes. Check https://factory.macrofab.com/parts for the house parts list.; MF: TDK; MPN: C3216X7R1H106K160AE; POPULATE: 1
C35 = controller:CAPACITOR_NP: Library: MF_Passives Description: Device for Non-Polarized Capacitors. Manufacture part number (MPN) can be added via Attributes. Check https://factory.macrofab.com/parts for the house parts list.; MF: TDK; MPN: C3216X7R1H106K160AE; POPULATE: 1
C38 = mfpassives:CAPACITOR_NP: Library: MF_Passives Description: Device for Non-Polarized Capacitors. Manufacture part number (MPN) can be added via Attributes. Check https://factory.macrofab.com/parts for the house parts list.; HOUSEPART: YES; MF: TDK; MPN: C1608X7R1E105K080AE; POPULATE: 1
C39 = mfpassives:CAPACITOR_NP: Library: MF_Passives Description: Device for Non-Polarized Capacitors. Manufacture part number (MPN) can be added via Attributes. Check https://factory.macrofab.com/parts for the house parts list.; MF: MURATA; MPN: GCM21BC72A105KE36L; POPULATE: 1
C40-C54 = controller:CAPACITOR_NP: Library: MF_Passives Description: Device for Non-Polarized Capacitors. Manufacture part number (MPN) can be added via Attributes. Check https://factory.macrofab.com/parts for the house parts list.; POPULATE: 0
C55 C64-C69 = mfpassives:CAPACITOR_NP: Library: MF_Passives Description: Device for Non-Polarized Capacitors. Manufacture part number (MPN) can be added via Attributes. Check https://factory.macrofab.com/parts for the house parts list.; POPULATE: 0
C57 = mfpassives:CAPACITOR_NP: Library: MF_Passives Description: Device for Non-Polarized Capacitors. Manufacture part number (MPN) can be added via Attributes. Check https://factory.macrofab.com/parts for the house parts list.; HOUSEPART: YES; MPN: MF-CAP-0402-0.01uF; POPULATE: 1
C58-C60 = controller:CAPACITOR_NP: Library: MF_Passives Description: Device for Non-Polarized Capacitors. Manufacture part number (MPN) can be added via Attributes. Check https://factory.macrofab.com/parts for the house parts list.; HOUSEPART: 1; MPN: MF-CAP-0402-1nF; POPULATE: 1
C61 C63 = mfpassives:CAPACITOR_NP: Library: MF_Passives Description: Device for Non-Polarized Capacitors. Manufacture part number (MPN) can be added via Attributes. Check https://factory.macrofab.com/parts for the house parts list.; MF: KYOCERA AVX; MPN: 12065C104KAZ2A; POPULATE: 1
C62 = controller:CAPACITOR_NP: Library: MF_Passives Description: Device for Non-Polarized Capacitors. Manufacture part number (MPN) can be added via Attributes. Check https://factory.macrofab.com/parts for the house parts list.; MF: KYOCERA AVX; MPN: 06035C104KAZ2A; POPULATE: 1
CAN1 CAN2 = controller:JST-PH3; MF: JST; MPN: S3B-PH-SM4-TB(LF)(SN); POPULATE: 1
D1 D5-D12 = BAT41KFILM:BAT41KFILM: STMicroelectronics 100V 200mA, Diode, 2-Pin SOD-523 BAT41KFILM Source: Datasheet <https://www.st.com/resource/en/datasheet/bat41.pdf>; DESCRIPTION: STMicroelectronics 100V 200mA, Diode, 2-Pin SOD-523 BAT41KFILM; HEIGHT: 0.7mm; MANUFACTURER_NAME: STMicroelectronics; MANUFACTURER_PART_NUMBER: BAT41KFILM; MF: ST; MOUSER_PART_NUMBER: 511-BAT41KFILM; MOUSER_PRICE-STOCK: https://www.mouser.co.uk/ProductDetail/STMicroelectronics/BAT41KFILM?qs=jZi1jxfVU94ZzsUNeiIqGg%3D%3D; MPN: BAT41KFILM; POPULATE: 1
D2 = mfleds:LED_SINGLE: Library: MF_LEDs Description: Device for Single LED Packages. Manufacture part number (MFG#) can be added via Attributes.; HOUSEPART: YES; MPN: MF-LED-0603-GREEN; POPULATE: 1; URL: https://factory.macrofab.com/part/MF-LED-0603-RED
D3 = mfleds:LED_SINGLE: Library: MF_LEDs Description: Device for Single LED Packages. Manufacture part number (MFG#) can be added via Attributes.; HOUSEPART: YES; MPN: MF-LED-0603-RED; POPULATE: 1; URL: https://factory.macrofab.com/part/MF-LED-0603-RED
D4 = controller:DUAL_TVS; ALT_MF: WURTH; ALT_MPN: 824022; MPN: CDSOT23-0502B; POPULATE: 1
ENC = controller:PICO-SPOX-6; POPULATE: 0
J1 J2 = controller:XT30; POPULATE: 1
L1 = controller:SRN4018-220M; ALT2_MF: WURTH; ALT2_MPN: 74404042330; ALT_MPN: SRN4026-330M; MANUFACTURER_PART_NUMBER: SRN4018-330M; MPN: SRN4018-330M; POPULATE: 1; VENDOR: Bourns Electronics
L2 L3 = controller:HALF_CHOKE; MPN: MF-RES-0805-0; POPULATE: 1
M1-M4 = controller:MOUNT; POPULATE: 0
Q1-Q6 = controller:TPH1R204PL; MF: Toshiba; MPN: TPH2R506PL,L1Q; POPULATE: 1
R1 R2 = mfpassives:RESISTOR: Library: MF_Passives Description: Device for Resistors. Manufacture part number (MPN), Voltage, Tolerance, and Wattage Rating can be added via Attributes. Check https://factory.macrofab.com/parts for the house parts list.; HOUSEPART: 1; MPN: MF-RES-0402-560; POPULATE: 1
R3 R4 R13 R14 = mfpassives:RESISTOR: Library: MF_Passives Description: Device for Resistors. Manufacture part number (MPN), Voltage, Tolerance, and Wattage Rating can be added via Attributes. Check https://factory.macrofab.com/parts for the house parts list.; HOUSEPART: YES; MPN: MF-RES-0402-2K; POPULATE: 1
R5 = mfpassives:RESISTOR: Library: MF_Passives Description: Device for Resistors. Manufacture part number (MPN), Voltage, Tolerance, and Wattage Rating can be added via Attributes. Check https://factory.macrofab.com/parts for the house parts list.; MF: Yageo; MPN: RC0402FR-07100KL; POPULATE: 1
R6 = mfpassives:RESISTOR: Library: MF_Passives Description: Device for Resistors. Manufacture part number (MPN), Voltage, Tolerance, and Wattage Rating can be added via Attributes. Check https://factory.macrofab.com/parts for the house parts list.; MF: Yageo; MPN: RC0402FR-074K7L; POPULATE: 1
R7 R9 = mfpassives:RESISTOR: Library: MF_Passives Description: Device for Resistors. Manufacture part number (MPN), Voltage, Tolerance, and Wattage Rating can be added via Attributes. Check https://factory.macrofab.com/parts for the house parts list.; MF: Yageo; MPN: RC0402FR-0710KL; POPULATE: 1
R8 = mfpassives:RESISTOR: Library: MF_Passives Description: Device for Resistors. Manufacture part number (MPN), Voltage, Tolerance, and Wattage Rating can be added via Attributes. Check https://factory.macrofab.com/parts for the house parts list.; MF: Murata; MPN: NCP15WB473F03RC; POPULATE: 1
R10-R12 R18-R21 = mfpassives:RESISTOR: Library: MF_Passives Description: Device for Resistors. Manufacture part number (MPN), Voltage, Tolerance, and Wattage Rating can be added via Attributes. Check https://factory.macrofab.com/parts for the house parts list.; POPULATE: 0
R15-R17 = controller:RESISTOR: Library: MF_Passives Description: Device for Resistors. Manufacture part number (MPN), Voltage, Tolerance, and Wattage Rating can be added via Attributes. Check https://factory.macrofab.com/parts for the house parts list.; HOUSEPART: 1; MPN: MF-RES-0402-22; POPULATE: 1
R22-R27 = mfpassives:RESISTOR: Library: MF_Passives Description: Device for Resistors. Manufacture part number (MPN), Voltage, Tolerance, and Wattage Rating can be added via Attributes. Check https://factory.macrofab.com/parts for the house parts list.; HOUSEPART: 1; MPN: MF-RES-0402-0; POPULATE: 1
RA RB RC = rcl:R-US_: RESISTOR, American symbol; MF: Stackpole Electronics; MPN: HCS1206FTL500; POPULATE: 1
SH1-SH3 = shorts:SHORT: Short between two nets; BOM: no; POPULATE: 0
SH4 = shorts:SHORT: Short between two nets; POPULATE: 0
SWD = controller:JST-ZH6; MF: JST; MPN: S6B-ZR-SM4A-TF(LF)(SN); POPULATE: 1
U1 = controller:STM32G474CEU6: STMICROELECTRONICS - STM32G474CEU6 - MCU, 32BIT, 170MHZ, UFQFPN-48 Source: Datasheet <https://componentsearchengine.com/Datasheets/1/STM32G474CEU6.pdf>; DESCRIPTION: STMICROELECTRONICS - STM32G474CEU6 - MCU, 32BIT, 170MHZ, UFQFPN-48; HEIGHT: 0.6mm; MANUFACTURER_NAME: STMicroelectronics; MANUFACTURER_PART_NUMBER: STM32G474CEU6; MOUSER_PART_NUMBER: 511-STM32G474CEU6; MOUSER_PRICE-STOCK: https://www.mouser.com/Search/Refine.aspx?Keyword=511-STM32G474CEU6; MPN: STM32G474CEU6; POPULATE: 1
U2 = controller:TCAN334G; MF: TI; MPN: TCAN334GDCNT; POPULATE: 1
U3 = controller:AS5147; MF: AMS; MPN: AS5047P-ATSM; POPULATE: 1
U4 = power_dist:MAX15062AATA+T; BUILT_BY: EMA_Jessica; COPYRIGHT: Copyright (C) 2018 Accelerated Designs. All rights reserved; MANUFACTURER_PART_NUMBER: MAX15062AATA+T; MPN: MAX15062AATA+T; POPULATE: 1; REVISION: 1; SOURCELIBRARY: Maxim_DP_2018-06-12; VENDOR: Maxim Integrated Products
U5 = controller:DRV8353S; MF: TI; MPN: DRV8353FSRTAR; POPULATE: 1
U6 = controller:TCAN334G; MF: TI; MPN: TCAN337GDR; POPULATE: 0

## Net classes
0 default: width 0.127 mm
1 CAN: width 0.216 mm, clearance 0.127 mm